# EAGLE design mac_schematic_print_top (EAGLE 8.7.0)
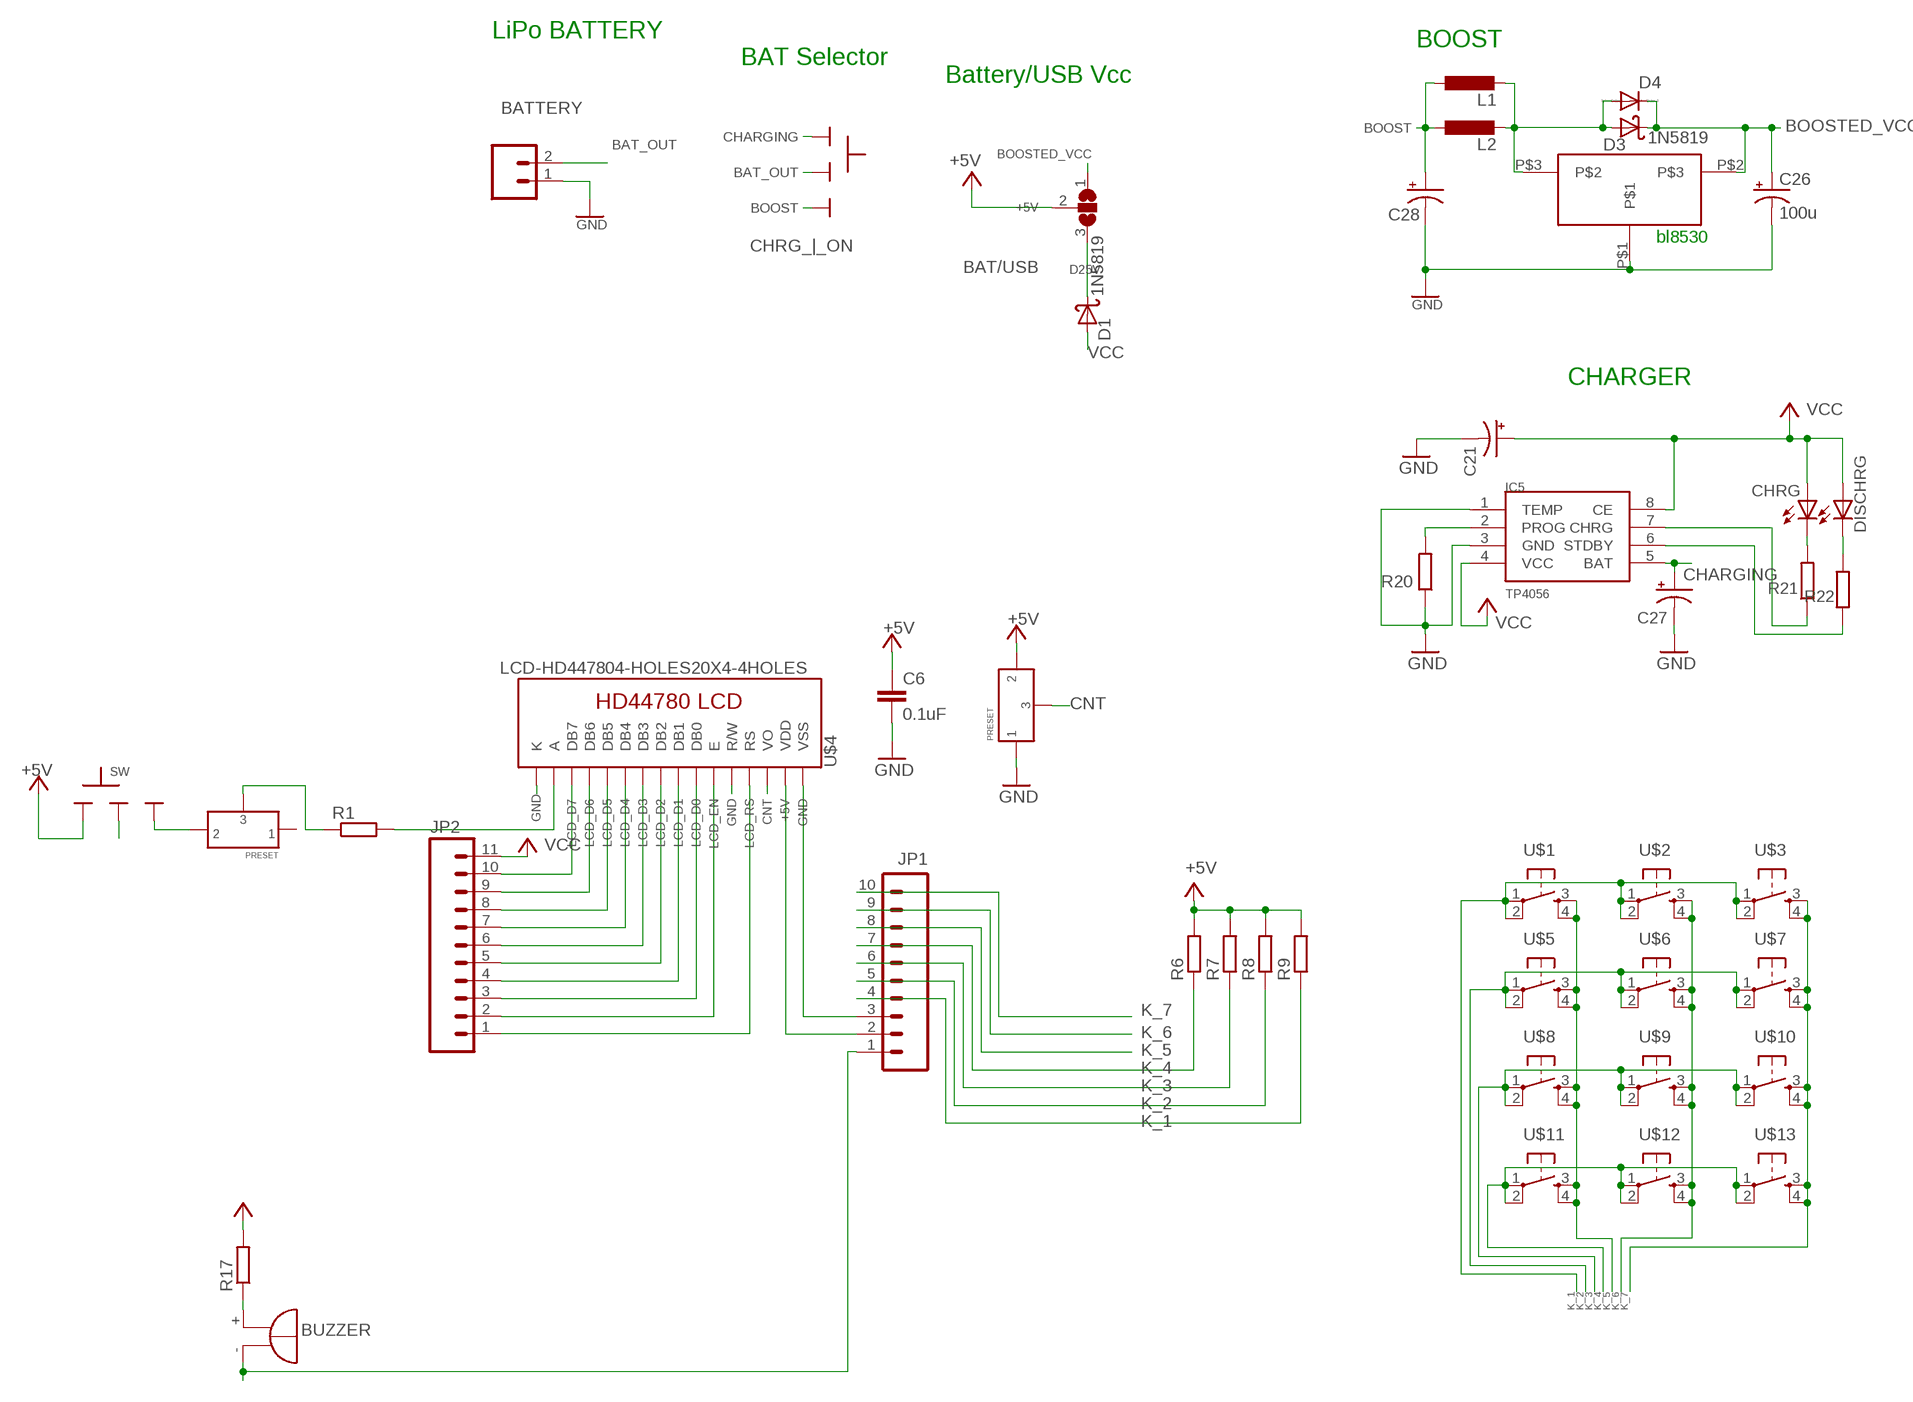
[diagram p0: schematic, sheet 1]

## Parts
BAT/USB  SJ2W  [SJ_2]
BATTERY  M02JST-PTH-2  M02  [02P]
C6  0.1uF  C-EUC0805K  [C0805K]
C21  10u  CAP_POL_10V  [C/6032-28R]
C26  100u  CAP_POL_10V  [C/6032-28R]
C27  10u  CAP_POL_10V  [C/6032-28R]
C28  10u  CAP_POL_10V  [C/6032-28R]
CHRG  LED3MM  [LED3MM]
CHRG_|_ON  SLIDESWITCH-BIG  [BIGSWITCH]
D1  1N5819  [DO41-10]
D3  1N5819  [DO41-10]
D4  DIODE_DIODE-DO214AC  [DIODE_DO214AC]
DISCHRG  LED3MM  [LED3MM]
IC5  TP4056  [SOP-8]
IC6  BL8530_5V  [BL8530_5V]
JP1  M10SILK_FEMALE_PTH  [1X10]
JP2  M11PTH  [1X11]
L1  L-EU6000-XXX-RC  [6000-XXXX-RC]
L2  47uH  L-EUL5650M  [L5650M]
PRESET  PRESET  PRESET_LR  [PRESET_LR]
PRESET1  PRESET  PRESET_LR  [PRESET_LR]
R1  R-EU_0204/7  [0204/7]
R6  R-EU_0204/7  [0204/7]
R7  R-EU_0204/7  [0204/7]
R8  R-EU_0204/7  [0204/7]
R9  R-EU_0204/7  [0204/7]
R17  R-EU_0204/7  [0204/7]
R20  R-EU_0204/7  [0204/7]
R21  470  R-EU_0204/7  [0204/7]
R22  470  R-EU_0204/7  [0204/7]
SG1  BUZZER  [F/TMB]
SW  SLIDESWITCH-BIG  [BIGSWITCH]
U$1  OMRON_SWITCH_40-XX  [B3F-40XX]
U$2  OMRON_SWITCH_40-XX  [B3F-40XX]
U$3  OMRON_SWITCH_40-XX  [B3F-40XX]
U$4  LCD-HD447804-HOLES20X4-4HOLES  [LCD-20X4-4HOLES]
U$5  OMRON_SWITCH_40-XX  [B3F-40XX]
U$6  OMRON_SWITCH_40-XX  [B3F-40XX]
U$7  OMRON_SWITCH_40-XX  [B3F-40XX]
U$8  OMRON_SWITCH_40-XX  [B3F-40XX]
U$9  OMRON_SWITCH_40-XX  [B3F-40XX]
U$10  OMRON_SWITCH_40-XX  [B3F-40XX]
U$11  OMRON_SWITCH_40-XX  [B3F-40XX]
U$12  OMRON_SWITCH_40-XX  [B3F-40XX]
U$13  OMRON_SWITCH_40-XX  [B3F-40XX]

## Nets
+5V: BAT/USB.2 C6.1 JP1.2 PRESET.P$2 R6.2 R7.2 R8.2 R9.2 R17.2 SW.1 U$4.P$2(VDD) ; supply symbol labelled VCC
BAT_OUT: BATTERY.2 CHRG_|_ON.2
BOOST: C28.+ CHRG_|_ON.3 L1.1 L2.1
BOOSTED_VCC: BAT/USB.1 C26.+ D3.C D4.C IC6.P$2
CHARGING: C27.+ CHRG_|_ON.1 IC5.5(BAT)
CNT: PRESET.P$3 U$4.P$3(VO)
D25V: BAT/USB.3 D1.C
GND: BATTERY.1 C6.2 C21.- C26.- C27.- C28.- IC5.1(TEMP) IC5.3(GND) IC6.P$1 JP1.3 PRESET.P$1 R20.1 U$4.P$1(VSS) U$4.P$5(R/W) U$4.P$16(K)
K_1: JP1.4 R9.1 U$1.1(P) U$1.2(P1) U$2.1(P) U$2.2(P1) U$3.1(P) U$3.2(P1)
K_2: JP1.5 R8.1 U$5.1(P) U$5.2(P1) U$6.1(P) U$6.2(P1) U$7.1(P) U$7.2(P1)
K_3: JP1.6 R7.1 U$8.1(P) U$8.2(P1) U$9.1(P) U$9.2(P1) U$10.1(P) U$10.2(P1)
K_4: JP1.7 R6.1 U$11.1(P) U$11.2(P1) U$12.1(P) U$12.2(P1) U$13.1(P) U$13.2(P1)
K_5: JP1.8 U$1.3(S) U$1.4(S1) U$5.3(S) U$5.4(S1) U$8.3(S) U$8.4(S1) U$11.3(S) U$11.4(S1)
K_6: JP1.9 U$2.3(S) U$2.4(S1) U$6.3(S) U$6.4(S1) U$9.3(S) U$9.4(S1) U$12.3(S) U$12.4(S1)
K_7: JP1.10 U$3.3(S) U$3.4(S1) U$7.3(S) U$7.4(S1) U$10.3(S) U$10.4(S1) U$13.3(S) U$13.4(S1)
LCD_D0: JP2.3 U$4.P$7(DB0)
LCD_D1: JP2.4 U$4.P$8(DB1)
LCD_D2: JP2.5 U$4.P$9(DB2)
LCD_D3: JP2.6 U$4.P$10(DB3)
LCD_D4: JP2.7 U$4.P$11(DB4)
LCD_D5: JP2.8 U$4.P$12(DB5)
LCD_D6: JP2.9 U$4.P$13(DB6)
LCD_D7: JP2.10 U$4.P$14(DB7)
LCD_EN: JP2.2 U$4.P$6(E)
LCD_RS: JP2.1 U$4.P$4(RS)
N$3: JP1.1 SG1.-
N$4: SW.2
N$5: PRESET1.P$2 SW.3
N$6: R1.2 U$4.P$15(A)
N$7: PRESET1.P$3 R1.1
N$9: R17.1 SG1.+
N$18: IC5.2(PROG) R20.2
N$19: IC5.7(CHRG) R21.1
N$25: IC5.6(STDBY) R22.1
N$27: CHRG.K(C) R21.2
N$28: DISCHRG.K(C) R22.2
N$29: D3.A D4.A IC6.P$3 L1.2 L2.2
VCC: C21.+ CHRG.A D1.A DISCHRG.A IC5.4(VCC) IC5.8(CE) JP2.11
Unconnected: PRESET1.P$1

## Notes on the sheet
- LiPo BATTERY
- BOOST
- BAT Selector
- Battery/USB Vcc
- bl8530
- CHARGER

## Library data of the parts
BAT/USB = jumper:SJ2W: SMD solder JUMPER
BATTERY = CEDT_JANUARY_2015_v5:M02: AMP QUICK CONNECTOR
C6 = resistor:C-EU: CAPACITOR, European symbol
C21 C26 = CEDT_JANUARY_2015_v7:CAP_POL
C27 C28 = CEDT_JANUARY_2015_v5:CAP_POL
CHRG DISCHRG = adafruit:LED: LED OSRAM: - CHIPLED LG R971, LG N971, LY N971, LG Q971, LY Q971, LO R971, LY R971 LH N974, LH R974 LS Q976, LO Q976, LY Q976 LO Q996 - Hyper CHIPLED LW Q18S LB Q993, LB Q99A, LB R99A - SideLED LS A670, LO A670, LY A670, LG A670, LP A670 LB A673, LV A673, LT A673, LW A673 LH A674 LY A675 LS A676, LA A676, LO A676, LY A676, LW A676 LS A679, LY A679, LG A679 - Hyper Micro SIDELED® LS Y876, LA Y876, LO Y876, LY Y876 LT Y87S - SmartLED LW L88C, LW L88S LB L89C, LB L89S, LG L890 LS L89K, LO L89K, LY L89K LS L896, LA L896, LO L896, LY L896 - TOPLED LS T670, LO T670, LY T670, LG T670, LP T670 LSG T670, LSP T670, LSY T670, LOP T670, LYG T670 LG T671, LOG T671, LSG T671 LB T673, LV T673, LT T673, LW T673 LH T674 LS T676, LA T676, LO T676, LY T676, LB T676, LH T676, LSB T676, LW T676 LB T67C, LV T67C, LT T67C, LS T67K, LO T67K, LY T67K, LW E67C LS E67B, LA E67B, LO E67B, LY E67B, LB E67C, LV E67C, LT E67C LW T67C LS T679, LY T679, LG T679 LS T770, LO T770, LY T770, LG T770, LP T770 LB T773, LV T773, LT T773, LW T773 LH T774 LS E675, LA E675, LY E675, LS T675 LS T776, LA T776, LO T776, LY T776, LB T776 LHGB T686 LT T68C, LB T68C - Hyper Mini TOPLED® LB M676 - Mini TOPLED Santana® LG M470 LS M47K, LO M47K, LY M47K Source: http://www.osram.convergy.de/
CHRG_|_ON SW = CEDT_JANUARY_2015_v5:SLIDESWITCH
D1 D3 = arduinodaya_v9:1N5819: DIODE general purpose rectifier, 1 A
D4 = TalkingTom_FINAL3_print:DIODE_DIODE-: DIODE
IC5 = TP4056:TP4056
IC6 = PSU_TT_SMD:BL8530_5V
JP1 = SparkFun-Connectors:M10: Header 10 Standard 10-pin 0.1" header. Use with straight break away headers (SKU : PRT-00116), right angle break away headers (PRT-00553), swiss pins (PRT-00743), machine pins (PRT-00117), and female headers (PRT-00115).; PROD_ID: CONN-11563
JP2 = SparkFun-Connectors:M11: Header 11 Standard 11-pin 0.1" header. Use with straight break away headers (SKU : PRT-00116), right angle break away headers (PRT-00553), swiss pins (PRT-00743), machine pins (PRT-00117), and female headers (PRT-00115).
L1 = rcl:L-EU: INDUCTOR, European symbol; SPICEPREFIX: L
L2 = rcl:L-EU: INDUCTOR, European symbol
PRESET PRESET1 = CEDT_JANUARY_2015_v5_a:PRESET_LR
R1 R6-R9 R17 = rcl:R-EU_: RESISTOR, European symbol; SPICEPREFIX: R
R20-R22 = rcl:R-EU_: RESISTOR, European symbol
SG1 = CEDT_JANUARY_2015_v5:BUZZER: BUZZER Source: Buerklin; OC_FARNELL: unknown; OC_NEWARK: unknown
U$1-U$3 U$5-U$13 = CEDT_JANUARY_2015_v5:OMRON_SWITCH
U$4 = HD44780LCD:LCD-HD44780

## Net classes
2 GND: width 0.406 mm, clearance 0.203 mm

## Board
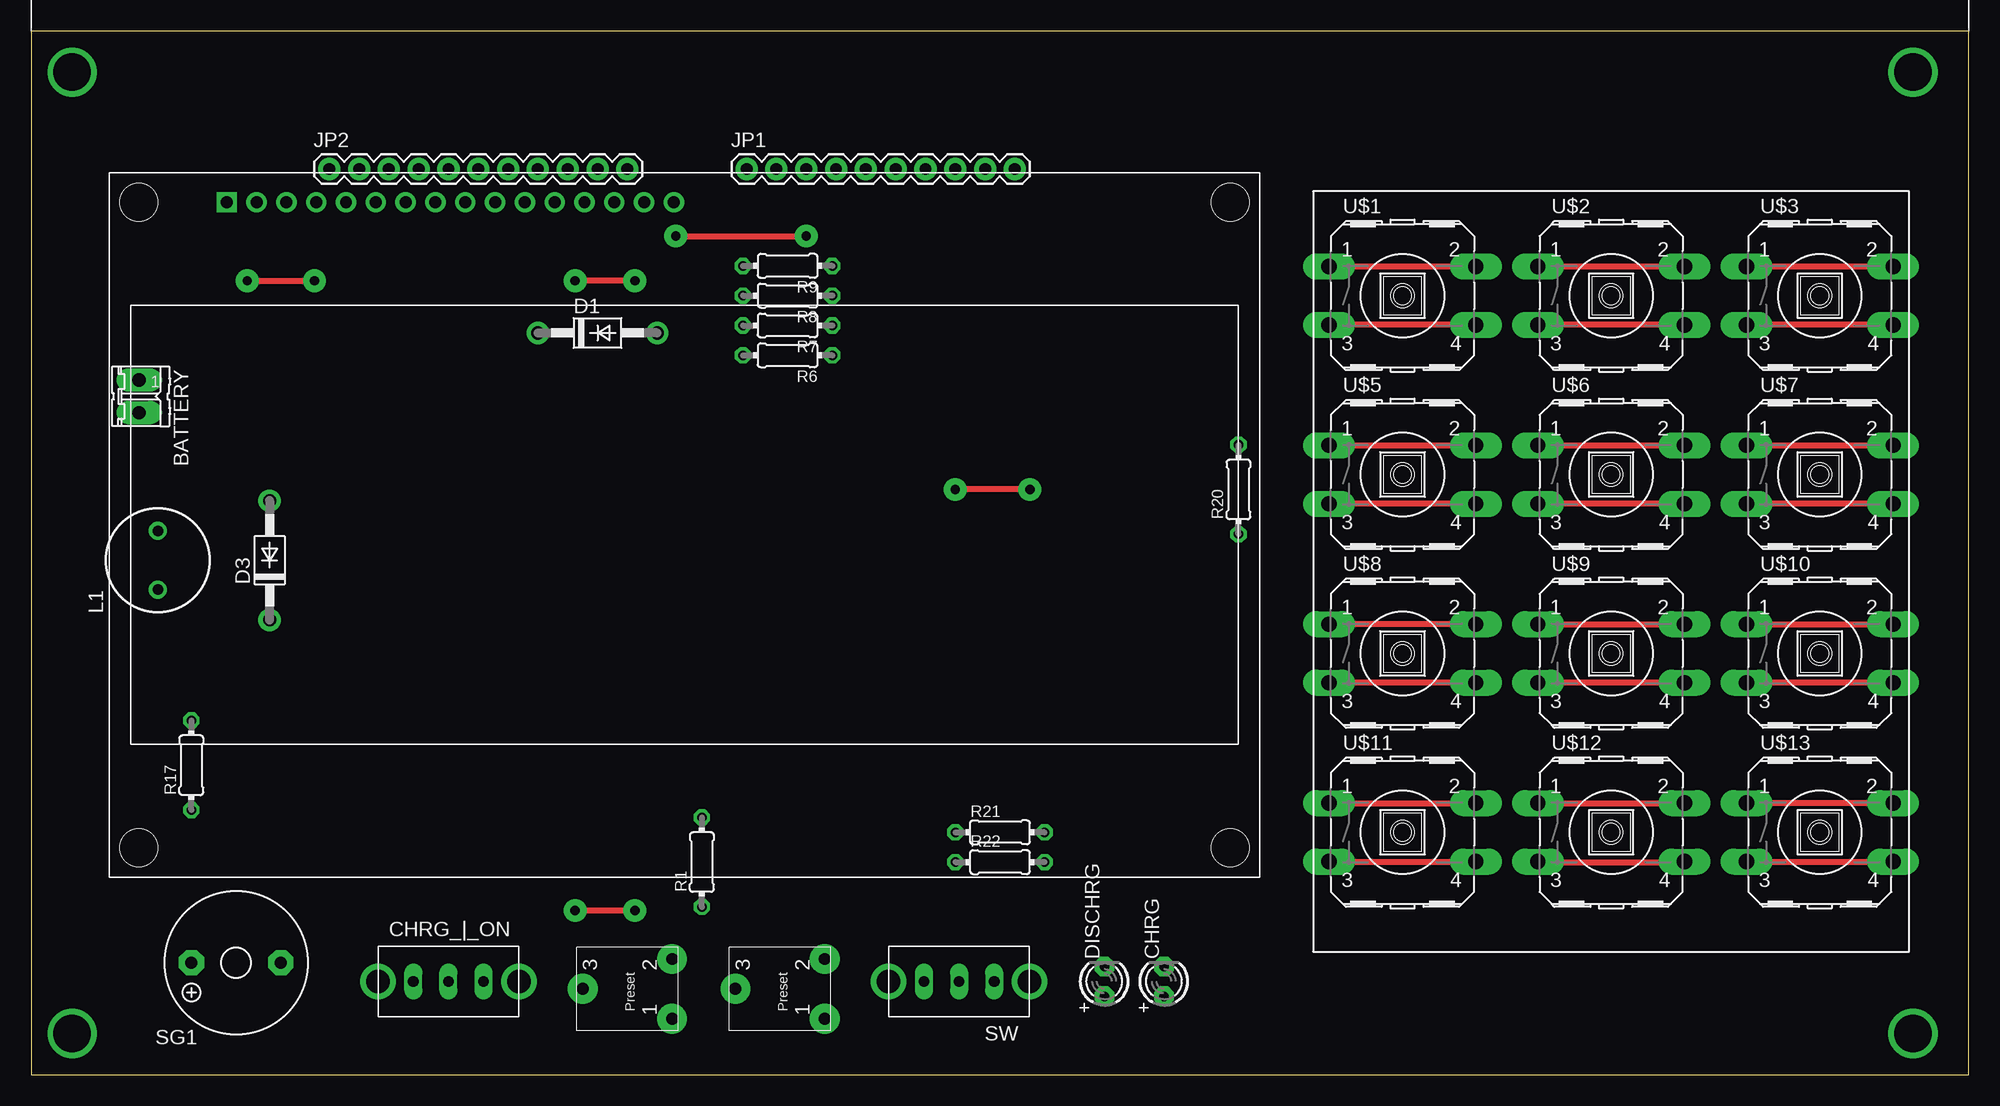
[diagram p1: board, top side]
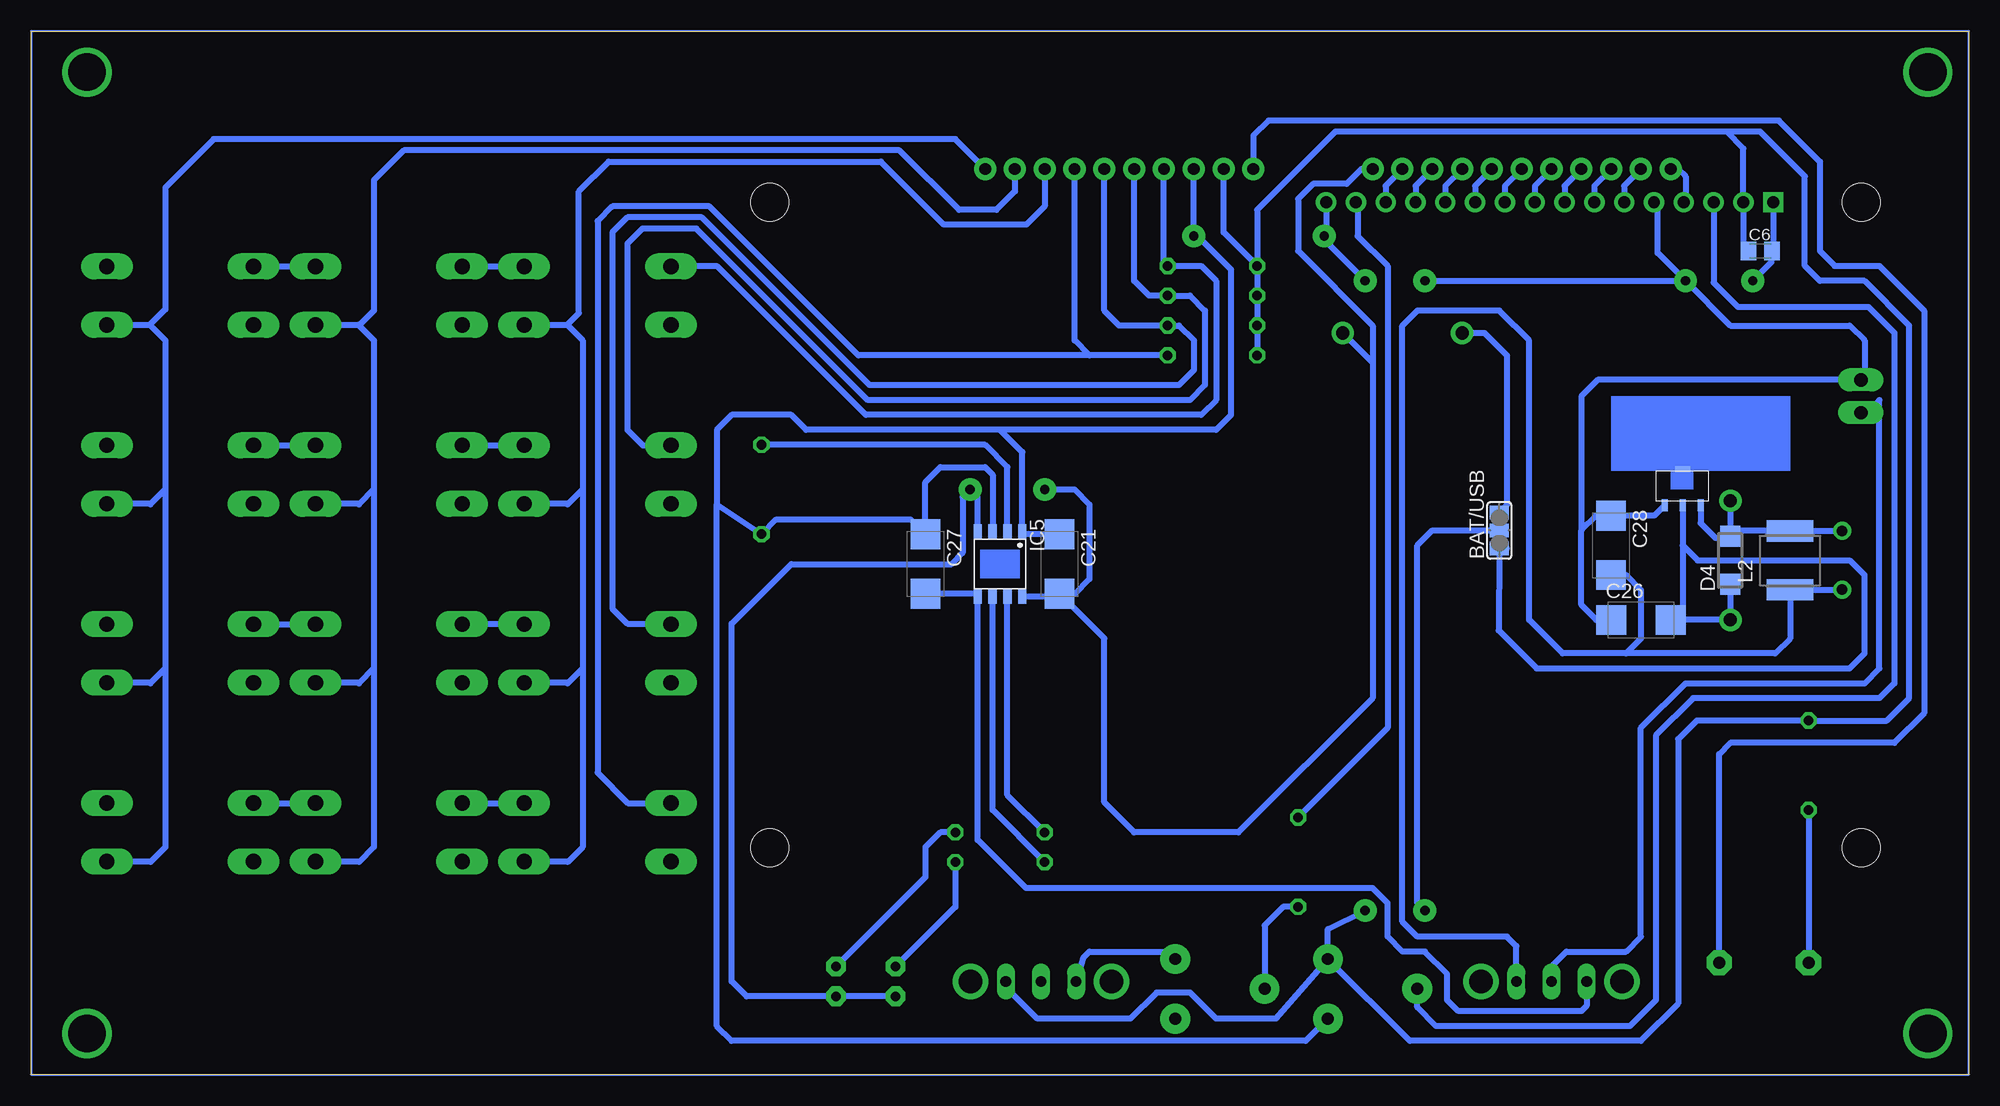
[diagram p2: board, bottom side, seen from below]

Size 165.1 x 88.9 mm. Coordinates in mm from the lower left corner, seen from the top.
Outline: 0,0 165.1,0 165.1,88.9 0,88.9 0,0
Copper layers (1*16): Top 0.035mm / dielectric 1.5mm / Bottom 0.035mm
Design rules "default *": minimum track width 20mil, minimum drill 0.35mm, track to track 12mil, track to pad 12mil, pad to pad 12mil, via to via 12mil, smd to smd 6mil, copper to edge 40mil, drill to drill 6mil, minimum pad ring 10mil, minimum via ring 8mil, stop-mask expansion 4mil, vias tented up to drill 0mil, thermal gap 10mil

### Footprints (pad centres in the part's own frame; a part is rotated, then mirrored left to right if it is on the bottom)
SJ_2 = smd 1.168 x 1.6: 1 -1.524,0; 2 0,0; 3 1.524,0
02P = drill 1.143 long: 1 -1.397,0; 2 1.397,0
C0805K = smd 1.3 x 1.6: 1 -1,0; 2 1,0
C/6032-28R = smd 2.55 x 2.5: + 2.525,0; - -2.525,0
LED3MM = drill 0.813 pad 1.676 octagon: A -1.27,0; K 1.27,0
BIGSWITCH = drill 0.9 long: 1 -3,0; 2 0,0; 3 3,0 | drill 2 pad 2.184: TAB1 -6,0; TAB2 6,0
DO41-10 = drill 1.118: A 5.08,0; C -5.08,0
DIODE_DO214AC = smd 1.8 x 1.7: A 2.05,0; C -2.05,0
SOP-8 = smd 1.3 x 0.7: 1 -2.75,1.905; 2 -2.75,0.635; 3 -2.75,-0.635; 4 -2.75,-1.905; 5 2.75,-1.905; 6 2.75,-0.635; 7 2.75,0.635; 8 2.75,1.905
BL8530_5V = smd 0.508 x 1.016: P$1 0.762,-0.381; P$2 2.286,-0.381; P$3 3.81,-0.381 | smd 1.27 x 0.508: P$4 2.286,2.667
1X10 = drill 1.016 pad 1.88: 1 0,0; 2 2.54,0; 3 5.08,0; 4 7.62,0; 5 10.16,0; 6 12.7,0; 7 15.24,0; 8 17.78,0; 9 20.32,0; 10 22.86,0
1X11 = drill 1.016 pad 1.88: 1 0,0; 2 2.54,0; 3 5.08,0; 4 7.62,0; 5 10.16,0; 6 12.7,0; 7 15.24,0; 8 17.78,0; 9 20.32,0; 10 22.86,0; 11 25.4,0
6000-XXXX-RC = drill 0.9 pad 1.422: 1 -2.5,0; 2 2.5,0
L5650M = smd 1.8 x 4: 1 -2.5,0; 2 2.5,0
PRESET_LR = drill 1.016 pad 2.54: P$1 -2.54,-3.81; P$2 2.54,-3.81; P$3 0,3.81
0204/7 = drill 0.813 octagon: 1 -3.81,0; 2 3.81,0
F/TMB = drill 1.016 pad 2.159 octagon: + 3.81,0; - -3.81,0
B3F-40XX = drill 1.3 long: 1 -6.248,2.489; 2 6.248,2.489; 3 -6.248,-2.489; 4 6.248,-2.489
LCD-20X4-4HOLES = drill 1.016 square: P$1 10,57.5 | drill 1.016: P$2 12.54,57.5; P$3 15.08,57.5; P$4 17.62,57.5; P$5 20.16,57.5; P$6 22.7,57.5; P$7 25.24,57.5; P$8 27.78,57.5; P$9 30.32,57.5; P$10 32.86,57.5; P$11 35.4,57.5; P$12 37.94,57.5; P$13 40.48,57.5; P$14 43.02,57.5; P$15 45.56,57.5; P$16 48.1,57.5 | hole 3.2: 2.5,2.5; 2.5,57.5; 95.5,57.5; 95.5,2.5

### Placement (x,y rotation side)
BAT/USB  40.01,46.35 90 bottom
BATTERY  9.21,57.78 270 top
C6  17.78,70.17 0 bottom
C21  77.47,43.5 270 bottom
C26  27.94,38.73 0 bottom
C27  88.9,43.5 270 bottom
C28  30.48,45.09 270 bottom
CHRG  96.52,7.94 90 top
CHRG_|_ON  35.56,7.94 0 top
D1  48.26,63.18 0 top
D3  20.32,43.81 90 top
D4  20.32,43.81 90 bottom
DISCHRG  91.44,7.94 90 top
IC5  82.55,43.5 270 bottom
IC6  26.67,48.9 0 bottom
JP1  60.96,77.15 0 top
JP2  25.4,77.15 0 top
L1  10.79,43.81 90 top
L2  15.24,43.81 90 bottom
PRESET  50.8,7.3 90 top
PRESET1  63.82,7.3 90 top
R1  57.15,18.1 90 top
R6  64.45,61.28 180 top
R7  64.45,63.82 180 top
R8  64.45,66.36 180 top
R9  64.45,68.9 180 top
R17  13.65,26.35 90 top
R20  102.87,49.85 90 top
R21  82.55,20.64 0 top
R22  82.55,18.1 0 top
SG1  17.46,9.53 180 top
SW  79.06,7.94 180 top
U$1  116.84,66.36 0 top
U$2  134.62,66.36 0 top
U$3  152.4,66.36 0 top
U$4  6.67,16.83 0 top
U$5  116.84,51.12 0 top
U$6  134.62,51.12 0 top
U$7  152.4,51.12 0 top
U$8  116.84,35.88 0 top
U$9  134.62,35.88 0 top
U$10  152.4,35.88 0 top
U$11  116.84,20.64 0 top
U$12  134.62,20.64 0 top
U$13  152.4,20.64 0 top

### Tracks (layer width: path | path; a pad name or v marks a point on that pad's centre or on a via)
+5V  (via drill 0.8 pad 1.93)
  Top 0.508: v51.44,13.97 v46.35,13.97
  Bottom 0.508: C6.1 19.21,70.59 U$4.P$2 19.21,78.9 20.64,80.33 | 20.64,80.33 53.98,80.33 60.64,73.66 R9.2 | R9.2 R8.2 R7.2 R6.2 | PRESET.P$2 59.05,4.76 64.14,4.76 66.36,6.99 69.22,6.99 71.44,4.76 79.38,4.76 81.42,6.81 SW.1 | PRESET.P$2 47.62,2.86 27.94,2.86 24.77,6.03 24.77,28.57 23.18,30.16 R17.2 6.99,30.16 5.08,32.07 5.08,63.82 8.89,67.63 12.7,67.63 13.97,68.9 13.97,76.52 17.78,80.33 20.64,80.33 | R9.2 63.5,71.75 JP1.2 | PRESET.P$2 54.61,12.38 v51.44,13.97 | v46.35,13.97 46.99,14.61 46.99,45.09 45.72,46.35 BAT/USB.2
BAT_OUT
  Bottom 0.508: CHRG_|_ON.2 35.56,9.21 34.29,10.48 29.21,10.48 27.94,11.75 27.94,29.53 24.13,33.34 8.89,33.34 7.62,34.61 7.62,57.47 8.57,56.2 10.29,56.39 BATTERY.2
BOOST
  Bottom 0.508: C28.+ 29.2,42.56 27.94,41.27 27.94,37.15 29.21,35.88 | CHRG_|_ON.3 38.56,10.94 39.37,11.75 46.99,11.75 48.26,13.02 48.26,63.82 46.99,65.09 40.01,65.09 37.47,62.55 37.47,38.73 34.61,35.88 29.21,35.88 | L1.1 L2.1 15.24,37.15 16.51,35.88 29.21,35.88
BOOSTED_VCC
  Bottom 0.508: IC6.P$2 24.38,45.09 | 24.38,45.09 24.38,39.77 C26.+ D3.C D4.C | 24.38,45.09 23.11,43.81 10.16,43.81 8.89,42.55 8.89,35.88 10.16,34.61 36.83,34.61 40.07,37.85 BAT/USB.1 39.37,44.83
CHARGING
  Bottom 0.508: C27.+ 84.68,40.97 IC5.5 84.45,20 80.33,15.88 50.8,15.88 49.53,14.61 49.53,11.75 48.26,10.48 46.35,10.48 44.45,8.57 44.45,6.35 43.5,5.4 33.02,5.4 32.56,5.86 CHRG_|_ON.1
CNT
  Bottom 0.508: U$4.P$3 21.75,67.47 19.68,65.41 8.57,65.41 6.35,63.18 6.35,33.34 7.62,32.07 23.5,32.07 26.67,28.89 26.67,6.35 28.89,4.13 45.4,4.13 46.99,5.71 PRESET.P$3
D25V
  Bottom 0.508: D1.C 41.27,63.18 39.37,61.28 39.37,48.51 BAT/USB.3
GND  (via drill 0.8 pad 1.93)
  Top 0.508: v18.41,67.63 v24.13,67.63 | v51.44,67.63 v46.35,67.63 | v54.93,71.44 v66.04,71.44
  Bottom 0.508: U$4.P$1 16.67,70.28 C6.2 16.83,69.48 16.83,69.22 v18.41,67.63 | v24.13,67.63 26.51,70.01 26.51,74.01 U$4.P$5 | PRESET.P$1 56.52,2.86 105.41,2.86 106.68,4.13 106.68,48.58 | IC6.P$1 26.81,47.61 C28.- 31.73,47.61 31.75,47.62 33.02,46.35 | C26.- 31.75,38.73 33.02,40.01 33.02,46.35 | 88.9,46.04 90.17,47.31 101.6,47.31 R20.1 106.68,48.58 | C21.- 80.42,46.02 IC5.1 80.64,53.02 82.55,54.93 | C27.- 88.9,46.04 | 88.9,46.04 88.9,50.48 87.63,51.75 83.82,51.75 83.19,51.12 IC5.3 | 82.55,54.93 99.06,54.93 100.33,56.2 105.41,56.2 106.68,54.93 106.68,48.58 | 54.77,70.96 U$4.P$16 54.9,73.69 | 54.77,70.96 v51.44,67.63 | v46.35,67.63 v24.13,67.63 | JP1.3 v66.04,71.44 65.72,71.44 62.87,68.58 62.87,56.2 64.14,54.93 82.55,54.93 | 33.02,46.35 33.02,57.78 31.62,59.18 BATTERY.1 8.89,59.5 8.89,62.55 10.16,63.82 20.32,63.82 v24.13,67.63 | v54.93,71.44 54.93,71.12 54.77,70.96
K_1
  Top 0.508: U$1.1 U$1.2 | U$2.1 U$2.2 | U$3.1 U$3.2
  Bottom 0.508: U$3.1 U$2.2 | U$2.1 123.24,68.85 123.19,68.9 123.14,68.9 U$1.2 | U$1.1 106.63,68.85 93.98,56.2 65.41,56.2 64.14,57.47 64.14,67.63 65.41,68.9 R9.1 68.58,68.9 JP1.4
K_2
  Top 0.508: U$5.1 U$5.2 | U$6.1 U$6.2 | U$7.1 U$7.2
  Bottom 0.508: U$7.1 U$6.2 | U$6.1 U$5.2 | JP1.5 71.12,67.63 69.85,66.36 R8.1 66.36,66.36 65.09,65.09 65.09,58.74 66.36,57.47 93.81,57.47 108.42,72.07 113.03,72.07 114.3,70.8 114.3,54.93 112.98,53.61 U$5.1
K_3
  Top 0.508: U$9.1 U$9.2 | U$10.1 U$10.2 | U$8.2 U$8.1
  Bottom 0.508: U$10.1 U$9.2 | JP1.6 73.66,65.09 72.39,63.82 R7.1 67.31,63.82 66.04,62.55 66.04,60.01 67.31,58.74 93.66,58.74 107.95,73.03 114.3,73.03 115.57,71.75 115.57,39.69 114.3,38.42 110.49,38.42 110.54,38.37 U$8.1 | U$8.2 U$9.1
K_4
  Top 0.508: U$11.1 U$11.2 | U$13.2 U$13.1 | U$12.1 U$12.2
  Bottom 0.508: U$13.1 U$12.2 | U$12.1 U$11.2 | JP1.7 76.2,62.55 74.93,61.28 | R6.1 74.93,61.28 | 74.93,61.28 94.61,61.28 107.31,73.98 115.57,73.98 116.84,72.71 116.84,25.72 114.25,23.13 U$11.1
K_5
  Top 0.508: U$1.4 U$1.3 110.54,63.87 110.49,63.82 | U$5.4 U$5.3 | U$8.4 U$8.3 | U$11.3 U$11.4
  Bottom 0.508: U$1.4 119.43,63.87 | 119.43,63.87 118.11,62.55 118.11,49.85 | 118.11,49.85 119.38,48.58 119.43,48.63 U$5.4 | 118.11,49.85 118.11,34.61 | 118.11,34.61 119.38,33.34 119.43,33.39 U$8.4 | 118.11,34.61 118.11,19.37 119.38,18.1 119.43,18.15 U$11.4 | JP1.8 78.74,73.98 80.31,72.41 87.33,72.41 92.71,77.79 115.89,77.79 118.43,75.25 118.43,64.87 119.43,63.87
K_6
  Top 0.508: U$2.4 U$2.3 | U$6.4 U$6.3 | U$9.4 U$9.3 | U$12.3 128.42,18.1 140.92,18.1 | 140.97,18.1 140.92,18.1 | 140.92,18.1 U$12.4
  Bottom 0.508: U$2.4 137.21,63.87 | 137.21,63.87 135.89,62.55 135.89,49.85 | 135.89,49.85 137.16,48.58 137.21,48.63 U$6.4 | 135.89,49.85 135.89,34.61 | 135.89,34.61 137.16,33.34 137.21,33.39 U$9.4 | 135.89,34.61 135.89,19.37 137.16,18.1 137.21,18.15 U$12.4 | JP1.9 81.28,75.25 82.87,73.66 86.04,73.66 91.12,78.74 133.35,78.74 135.89,76.2 135.89,65.09 137.11,63.87 137.21,63.87
K_7
  Top 0.508: U$3.4 U$3.3 | U$7.4 U$7.3 | U$10.4 U$10.3 | U$13.3 U$13.4
  Bottom 0.508: U$3.4 154.99,63.87 | 154.99,63.87 153.67,62.55 153.67,49.85 | 153.67,49.85 154.94,48.58 154.99,48.63 U$7.4 | 153.67,49.85 153.67,34.61 | 153.67,34.61 154.94,33.34 154.99,33.39 U$10.4 | 153.67,34.61 153.67,19.37 154.94,18.1 154.99,18.15 U$13.4 | JP1.10 86.36,79.69 149.54,79.69 153.67,75.56 153.67,65.19 154.99,63.87
LCD_D0
  Bottom 0.508: JP2.3 31.91,75.72 U$4.P$7
LCD_D1
  Bottom 0.508: JP2.4 34.45,75.72 U$4.P$8
LCD_D2
  Bottom 0.508: JP2.5 36.99,75.72 U$4.P$9
LCD_D3
  Bottom 0.508: JP2.6 39.53,75.72 U$4.P$10
LCD_D4
  Bottom 0.508: JP2.7 42.07,75.72 U$4.P$11
LCD_D5
  Bottom 0.508: JP2.8 44.61,75.72 U$4.P$12
LCD_D6
  Bottom 0.508: JP2.9 47.15,75.72 U$4.P$13
LCD_D7
  Bottom 0.508: JP2.10 49.69,75.72 U$4.P$14
LCD_EN
  Bottom 0.508: JP2.2 29.37,75.72 U$4.P$6
LCD_RS
  Bottom 0.508: JP2.1 24.77,77.15 24.13,76.52 24.13,74.17 U$4.P$4
N$1  (via drill 3.17 pad 3.81)
  other vias: 160.34,3.49
N$2  (via drill 3.17 pad 3.81)
  other vias: 3.49,3.49
N$3
  Bottom 0.508: SG1.- 21.27,27.3 20.32,28.26 6.35,28.26 3.81,30.8 3.81,65.09 7.62,68.9 11.43,68.9 12.7,70.17 12.7,77.79 16.19,81.28 59.69,81.28 60.96,80.01 JP1.1
N$5
  Bottom 0.508: SW.3 75.42,9.98 74.93,10.48 68.26,10.48 PRESET1.P$2
N$6
  Bottom 0.508: U$4.P$15 52.07,74.17 52.07,71.44 49.53,68.9 49.53,29.53 R1.2
N$7
  Bottom 0.508: R1.1 58.42,14.29 60.01,12.7 PRESET1.P$3
N$8  (via drill 3.17 pad 3.81)
  other vias: 160.34,85.41
N$9
  Bottom 0.508: R17.1 SG1.+
N$10  (via drill 3.17 pad 3.81)
  other vias: 3.49,85.41
N$11
  Bottom 0.152: 0,0 0,88.9 165.1,88.9 165.1,0 0,0
N$18
  Bottom 0.508: IC5.2 81.92,51.75 83.82,53.66 R20.2
N$19
  Bottom 0.508: R21.1 81.92,23.81 IC5.7
N$25
  Bottom 0.508: R22.1 83.19,22.54 IC5.6
N$27
  Bottom 0.508: R21.2 87.63,20.64 88.9,19.37 88.9,16.83 CHRG.K
N$28
  Bottom 0.508: R22.2 86.36,14.29 DISCHRG.K
N$29
  Bottom 0.508: IC6.P$3 22.86,46.99 21.59,45.72 20.46,45.72 D4.A | D3.A D4.A | D4.A 19.87,46.31 L2.2 L1.2
VCC  (via drill 0.8 pad 1.93)
  Top 0.508: v85.09,49.85 v78.74,49.85
  Bottom 0.508: JP2.11 51.75,77.15 53.02,75.88 55.88,75.88 57.15,74.61 57.15,70.17 50.8,63.82 50.8,60.64 | C21.+ 77.69,40.75 IC5.8 | IC5.4 84.45,49.21 v85.09,49.85 85.72,49.21 85.72,44.45 86.68,43.5 100.33,43.5 105.41,38.42 105.41,7.94 104.14,6.67 CHRG.A DISCHRG.A | v78.74,49.85 76.2,49.85 74.93,48.58 74.93,42.23 76.2,40.96 77.45,40.96 | 77.47,40.96 C21.+ | 50.8,60.64 50.8,32.07 62.23,20.64 71.12,20.64 73.66,23.18 73.66,37.16 77.45,40.96 | 77.45,40.96 C21.+ | D1.A 50.8,60.64
(copper drawn outside any net)
  shapes: Bottom area x2